# Altium project STM32F031-N30-EVAL.PrjPcb
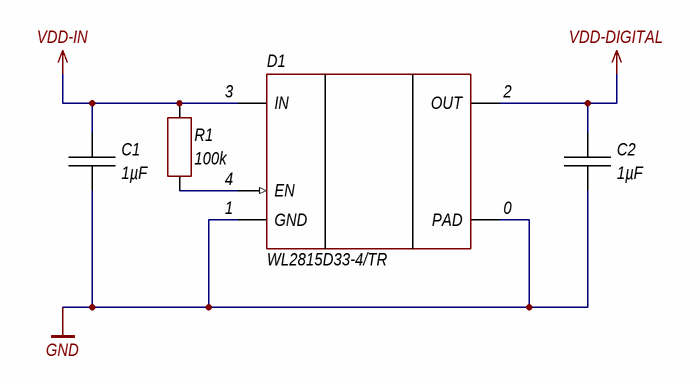
[diagram p0: PowerSupply.SchDoc]
ProjectVersion: 0.1.1; ProjectNumber: STM32F031-N30-EVAL; ProjectDescription2Line: Project description 2; ProjectDescription: Project description; ProjectDateShort: 2021.10; ProjectDate: 16.10.2021; ProjectCompanyName: Azek Clark © 2021; ProjectBoardType: MAINB; ProjectAuthor: Clark A.
8 sheets, 65 parts. Net scope: flat (ports and power ports of the same name join across sheets).
Board file: PCB.PcbDoc
Sheets:
  PowerSupply.SchDoc
  MCU-Power.SchDoc
  MCU-IO.SchDoc
  MCU-Debug.SchDoc
  GPIO-Debug.SchDoc
  Connector-side-1.SchDoc
  Connector-side-2.SchDoc
  LED&Button.SchDoc

## Sheet PowerSupply.SchDoc: =ProjectDescription
size 297 x 209 mm; Author: Clark A.; CompanyName: Azek Clark © 2021; Address1: Address1; Address2: Address2; Address3: Address3; Address4: Address4; DocumentNumber: STM32F031-N30-EVAL-0.1.1-MAINB Э3; SheetNumber: 1; SheetTotal: 7; Scale: 1:1; DocumentType: Схема электрическая принципиальная; FirstReferrence: STM32F031-N30-EVAL; Title2str: Project description 2

### Parts
C1  1µF  [CH0402C]
C2  1µF  [CH0402C]
D1  WL2815D33-4/TR  [DFN1010-4]
R1  100k  [CH0402R]

### Nets
GND: C1.1 C2.1 D1.0(PAD) D1.1(GND)
VDD-DIGITAL: C2.2 D1.2(OUT)
VDD-IN: C1.2 D1.3(IN) R1.2
NetD1_4: D1.4(EN) R1.1

### Notes on the sheet
- Утв.
- Н.контр.
- Т.контр.
- Пров.
- Разраб.
- Изм.
- Лист
- № докум.
- Подп.
- Дата
- Копировал
- Формат А4
- Лит.
- Листов
- Масса
- Масштаб

### Library data of the parts
C1 C2 = Capacitor: Manufacturer: *; Model: *; HelpURL: *; ComponentKind: *; Value: 1µF
D1 = WL2815: LDO; Model: WL2815D33-4/TR; HelpURL: https://www.lcsc.com/product-detail/Linear-Voltage-Regulators-LDO_WILLSEMI-Will-Semicon-WL2815D33-4-TR_C506126.html; ComponentKind: DFN1010-4, 5.25V, 300mA
R1 = Resistor: Manufacturer: *; Model: *; HelpURL: *; ComponentKind: *; Value: 100k

## Sheet MCU-Power.SchDoc: =ProjectDescription
size 297 x 209 mm; Author: Clark A.; CompanyName: Azek Clark © 2021; Address1: Address1; Address2: Address2; Address3: Address3; Address4: Address4; DocumentNumber: STM32F031-N30-EVAL-0.1.1-MAINB Э3; SheetNumber: 2; SheetTotal: 7; Scale: 1:1; DocumentType: Схема электрическая принципиальная; FirstReferrence: STM32F031-N30-EVAL
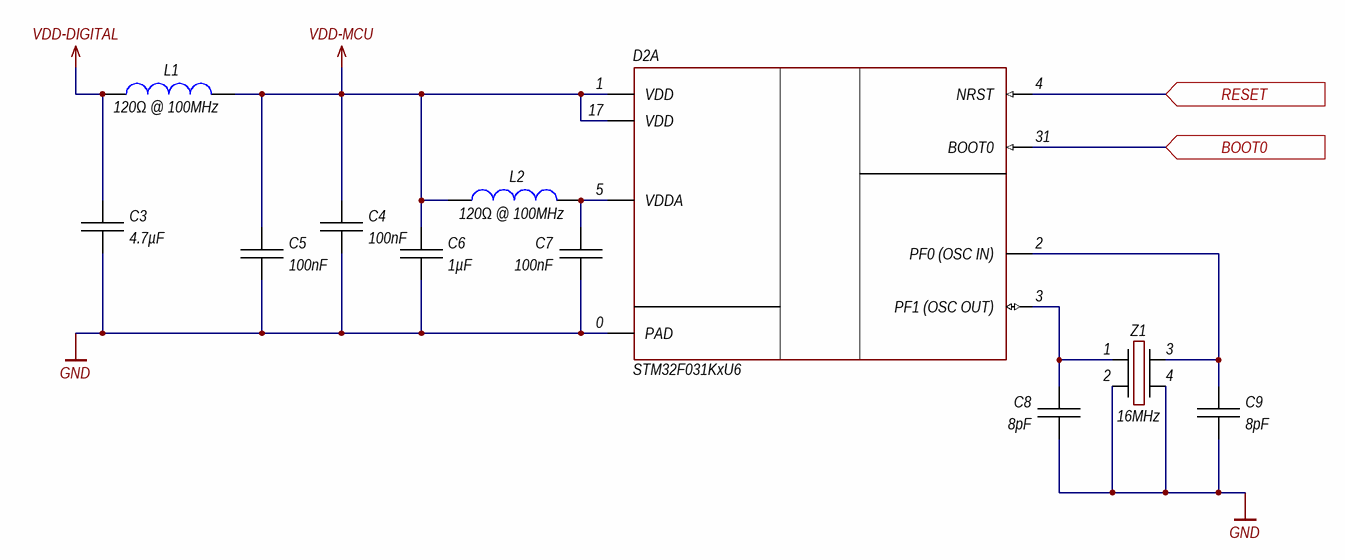
[diagram p1: MCU-Power.SchDoc]

### Parts
C3  4.7µF  [CH0402C]
C4  100nF  [CH0402C]
C5  100nF  [CH0402C]
C6  1µF  [CH0402C]
C7  100nF  [CH0402C]
C8  8pF  [CH0402C]
C9  8pF  [CH0402C]
D2  STM32F031KxU6  [32-UFQFPN]  (part A of 2)
L1  120Ω @ 100MHz  [CH0402L]
L2  120Ω @ 100MHz  [CH0402L]
Z1  16MHz  [OSC: 2520]

### Ports
BOOT0 (in), RESET (in)

### Nets
GND: C3.1 C4.1 C5.1 C6.1 C7.1 C8.1 C9.1 D2.0(PAD) Z1.2 Z1.4
VDD-DIGITAL: C3.2 L1.2
VDD-MCU: C4.2 C5.2 C6.2 D2.1(VDD) D2.17(VDD) L1.1 L2.2
BOOT0: D2.31(BOOT0) ; port BOOT0
RESET: D2.4(NRST) ; port RESET
NetC7_2: C7.2 D2.5(VDDA) L2.1
NetC8_2: C8.2 D2.3(PF1_(OSC_OUT)) Z1.1
NetC9_2: C9.2 D2.2(PF0_(OSC_IN)) Z1.3

### Notes on the sheet
- Изм.
- Лист
- № докум.
- Подп.
- Дата
- Копировал
- Формат А4

### Library data of the parts
C3-C9 = Capacitor: Manufacturer: *; Model: *; HelpURL: *; ComponentKind: *
  C3: Value: 4.7µF
  C4 C5 C7: Value: 100nF
  C6: Value: 1µF
  C8 C9: Value: 8pF
D2 = STM32F031KxU6: STM32, Cortex-M0; Manufacturer: ST Microelectronics; Model: STM32F031KxU6; ComponentKind: STM32, 2.0-3.6V, 32-UFQFPN; HelpURL: https://lcsc.com/product-detail/ST-Microelectronics_STMicroelectronics-STM32F031K6U6_C97412.html
L1 L2 = Inductor: Manufacturer: *; Model: *; HelpURL: *; ComponentKind: *; Value: 120Ω @ 100MHz
Z1 = Generator: Manufacturer: *; Model: *; HelpURL: *; ComponentKind: *; Value: 16MHz

## Sheet MCU-IO.SchDoc: =ProjectDescription
size 297 x 209 mm; Author: Clark A.; CompanyName: Azek Clark © 2021; Address1: Address1; Address2: Address2; Address3: Address3; Address4: Address4; DocumentNumber: STM32F031-N30-EVAL-0.1.1-MAINB Э3; SheetNumber: 3; SheetTotal: 7; Scale: 1:1; DocumentType: Схема электрическая принципиальная; FirstReferrence: STM32F031-N30-EVAL
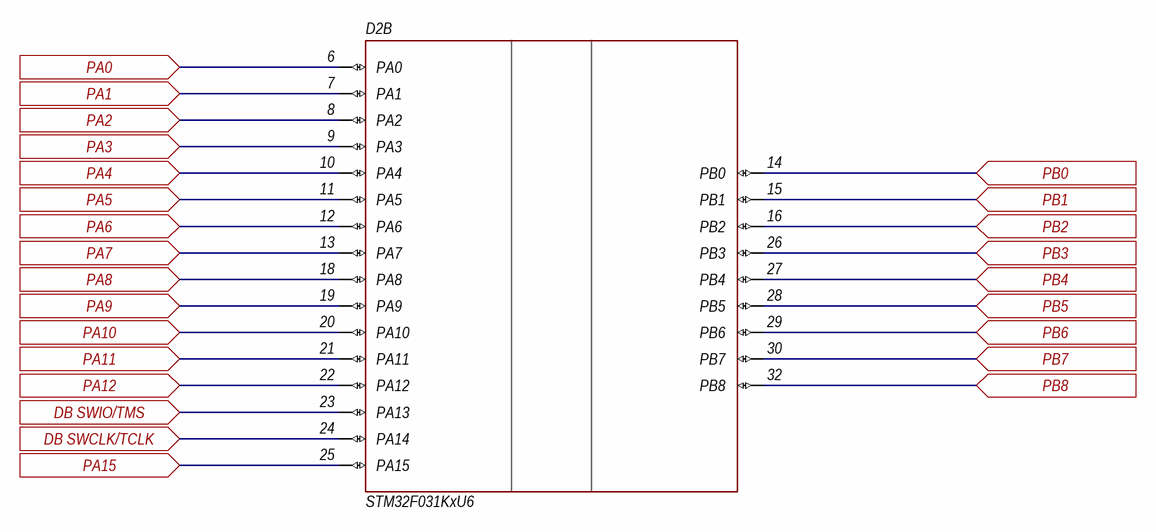
[diagram p2: MCU-IO.SchDoc]

### Parts
D2  STM32F031KxU6  [32-UFQFPN]  (part B of 2)

### Ports
DB SWCLK/TCLK (in), DB SWIO/TMS (in), PA0 (in), PA1 (in), PA2 (in), PA3 (in), PA4 (in), PA5 (in), PA6 (in), PA7 (in), PA8 (in), PA9 (in), PA10 (in), PA11 (in), PA12 (in), PA15 (in), PB0 (in), PB1 (in), PB2 (in), PB3 (in), PB4 (in), PB5 (in), PB6 (in), PB7 (in), PB8 (in)

### Nets
DB SWCLK/TCLK: D2.24(PA14) ; port DB SWCLK/TCLK
DB SWIO/TMS: D2.23(PA13) ; port DB SWIO/TMS
PA0: D2.6(PA0) ; port PA0
PA1: D2.7(PA1) ; port PA1
PA2: D2.8(PA2) ; port PA2
PA3: D2.9(PA3) ; port PA3
PA4: D2.10(PA4) ; port PA4
PA5: D2.11(PA5) ; port PA5
PA6: D2.12(PA6) ; port PA6
PA7: D2.13(PA7) ; port PA7
PA8: D2.18(PA8) ; port PA8
PA9: D2.19(PA9) ; port PA9
PA10: D2.20(PA10) ; port PA10
PA11: D2.21(PA11) ; port PA11
PA12: D2.22(PA12) ; port PA12
PA15: D2.25(PA15) ; port PA15
PB0: D2.14(PB0) ; port PB0
PB1: D2.15(PB1) ; port PB1
PB2: D2.16(PB2) ; port PB2
PB3: D2.26(PB3) ; port PB3
PB4: D2.27(PB4) ; port PB4
PB5: D2.28(PB5) ; port PB5
PB6: D2.29(PB6) ; port PB6
PB7: D2.30(PB7) ; port PB7
PB8: D2.32(PB8) ; port PB8

### Notes on the sheet
- Изм.
- Лист
- № докум.
- Подп.
- Дата
- Копировал
- Формат А4

### Library data of the parts
D2 = STM32F031KxU6: as D2 on sheet MCU-Power; Model: STM32F031KxU6; ComponentKind: STM32, 2.0-3.6V, 32-UFQFPN; HelpURL: https://lcsc.com/product-detail/ST-Microelectronics_STMicroelectronics-STM32F031K6U6_C97412.html

## Sheet MCU-Debug.SchDoc: =ProjectDescription
size 297 x 209 mm; Author: Clark A.; CompanyName: Azek Clark © 2021; Address1: Address1; Address2: Address2; Address3: Address3; Address4: Address4; DocumentNumber: STM32F031-N30-EVAL-0.1.1-MAINB Э3; SheetNumber: 4; SheetTotal: 7; Scale: 1:1; DocumentType: Схема электрическая принципиальная; FirstReferrence: STM32F031-N30-EVAL
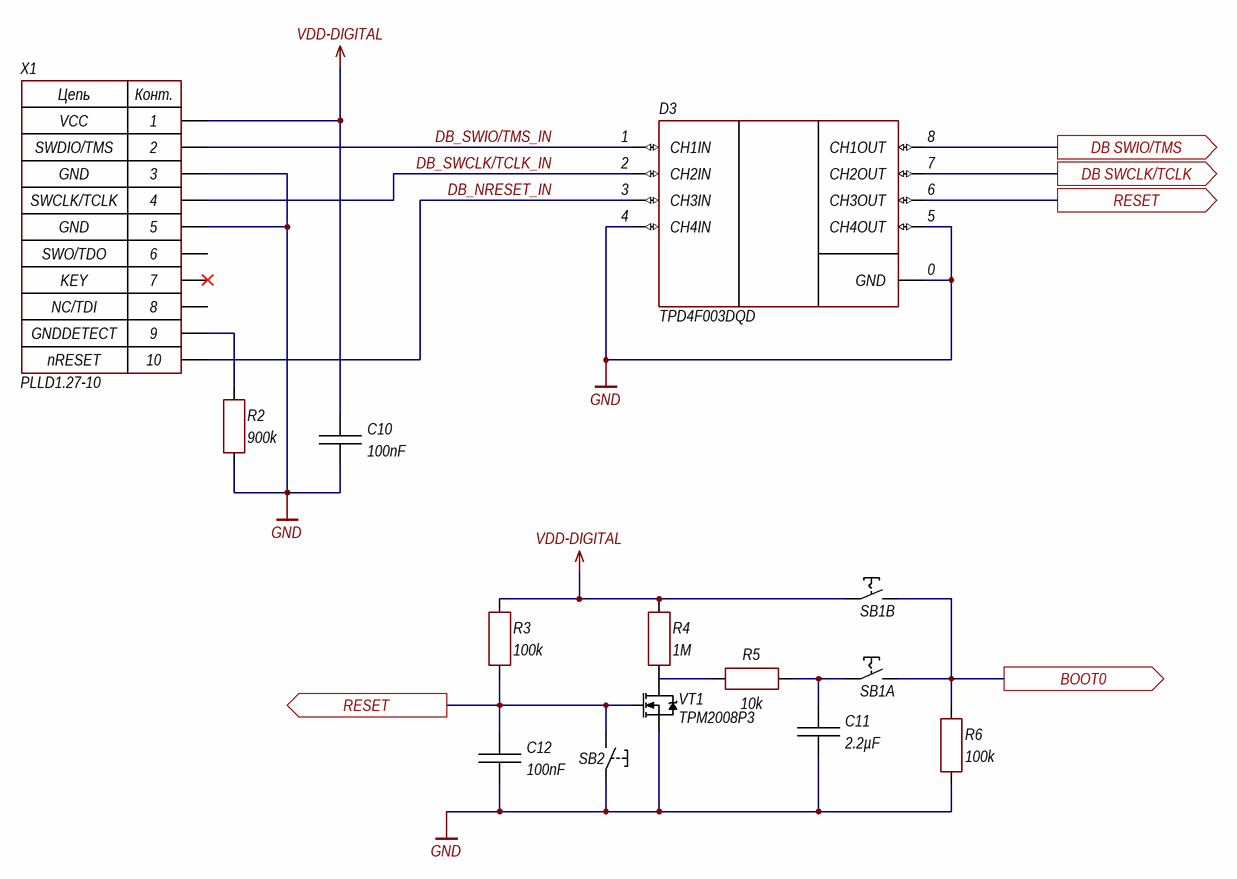
[diagram p3: MCU-Debug.SchDoc]

### Parts
C10  100nF  [CH0402C]
C11  2.2µF  [CH0402C]
C12  100nF  [CH0402C]
D3  TPD4F003DQD  [8-WSON (1.7x1.35 mm)]
R2  900k  [CH0402R]
R3  100k  [CH0402R]
R4  1M  [CH0402R]
R5  10k  [CH0402R]
R6  100k  [CH0402R]
SB1  *  [BUT: DSHP02TS]  (value not drawn)  (parts A,B of 2)
SB2  "Кнопка"  [BUT: YTS-A017]  (value not drawn)
VT1  TPM2008P3  [DFN1006-3L]
X1  PLLD1.27-10  [CON: PLLD-1.27-10]

### Ports
BOOT0 (out), DB SWCLK/TCLK (out), DB SWIO/TMS (out), RESET (out)

### Nets
GND: C10.1 C11.1 C12.1 D3.0(GND) D3.4(CH4IN) D3.5(CH4OUT) R2.1 R6.1 SB2.1 VT1.3(S) X1.3 X1.5
VDD-DIGITAL: C10.2 R3.2 R4.2 SB1.2 X1.1
BOOT0: R6.2 SB1.3 SB1.4 ; port BOOT0
DB SWCLK/TCLK: D3.7(CH2OUT) ; port DB SWCLK/TCLK
DB SWIO/TMS: D3.8(CH1OUT) ; port DB SWIO/TMS
DB_NRESET_IN: D3.3(CH3IN) X1.10
DB_SWCLK/TCLK_IN: D3.2(CH2IN) X1.4
DB_SWIO/TMS_IN: D3.1(CH1IN) X1.2
RESET: C12.2 D3.6(CH3OUT) R3.1 SB2.2 VT1.1(G) ; port RESET
NetC11_2: C11.2 R5.2 SB1.1
NetR2_2: R2.2 X1.9
NetR4_1: R4.1 R5.1 VT1.2(D)

Not connected (* = marked no-connect by the designer): X1 6 7* 8

### Notes on the sheet
- VCC
- SWDIO/TMS
- SWCLK/TCLK
- GND
- SWO/TDO
- KEY
- NC/TDI
- nRESET
- GNDDETECT
- Изм.
- Лист
- № докум.
- Подп.
- Дата
- Копировал
- Формат А4
- (in symbol 10-Connector) Цепь; Конт.

### Library data of the parts
C10-C12 = Capacitor: Manufacturer: *; Model: *; HelpURL: *; ComponentKind: *
  C10 C12: Value: 100nF
  C11: Value: 2.2µF
D3 = TPD4F003: 4-bit IO protection; Manufacturer: Texas Instruments; Model: TPD4F003DQD; ComponentKind: EMI Filter With Integrated ESD Protection; HelpURL: https://www.chipdip.ru/product1/8002950921
R2-R6 = Resistor: Manufacturer: *; Model: *; HelpURL: *; ComponentKind: *
  R2: Value: 900k
  R3 R6: Value: 100k
  R4: Value: 1M
  R5: Value: 10k
SB1 = 2(1)-Switch: 2 Array, latching; Manufacturer: *; Model: *; HelpURL: *; ComponentKind: *
SB2 = 1-Button: Button, no latching; Manufacturer: *; Model: *; HelpURL: *; ComponentKind: *
VT1 = N-chanel: Mosfet; Manufacturer: TECH PUBLIC; Model: TPM2008P3; ComponentKind: 20V, 1.1V, 0.7A; HelpURL: https://www.lcsc.com/product-detail/MOSFETs_TECH-PUBLIC-TPM2008P3_C708974.html
X1 = 10-Connector: Model: PLLD1.27-10; Manufacturer: *; HelpURL: *; ComponentKind: *

## Sheet GPIO-Debug.SchDoc: =ProjectDescription
size 297 x 209 mm; Author: Clark A.; CompanyName: Azek Clark © 2021; Address1: Address1; Address2: Address2; Address3: Address3; Address4: Address4; DocumentNumber: STM32F031-N30-EVAL-0.1.1-MAINB Э3; SheetNumber: 5; SheetTotal: 8; Scale: 1:1; DocumentType: Схема электрическая принципиальная; FirstReferrence: STM32F031-N30-EVAL
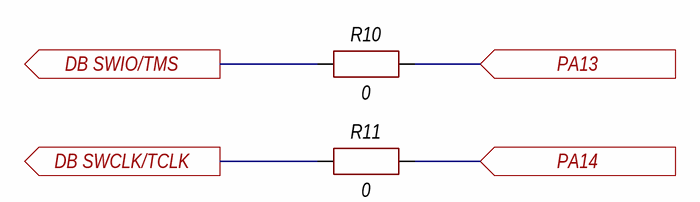
[diagram p4: GPIO-Debug.SchDoc]

### Parts
R10  0  [CH0402R]
R11  0  [CH0402R]

### Ports
DB SWCLK/TCLK (out), DB SWIO/TMS (out), PA13 (in), PA14 (in)

### Nets
DB SWCLK/TCLK: R11.1 ; port DB SWCLK/TCLK
DB SWIO/TMS: R10.1 ; port DB SWIO/TMS
PA13: R10.2 ; port PA13
PA14: R11.2 ; port PA14

### Notes on the sheet
- Изм.
- Лист
- № докум.
- Подп.
- Дата
- Копировал
- Формат А4

### Library data of the parts
R10 R11 = Resistor: Manufacturer: *; Model: *; HelpURL: *; ComponentKind: *; Value: 0

## Sheet Connector-side-1.SchDoc: =ProjectDescription
size 297 x 209 mm; Author: Clark A.; CompanyName: Azek Clark © 2021; Address1: Address1; Address2: Address2; Address3: Address3; Address4: Address4; DocumentNumber: STM32F031-N30-EVAL-0.1.1-MAINB Э3; SheetNumber: 5; SheetTotal: 7; Scale: 1:1; DocumentType: Схема электрическая принципиальная; FirstReferrence: STM32F031-N30-EVAL
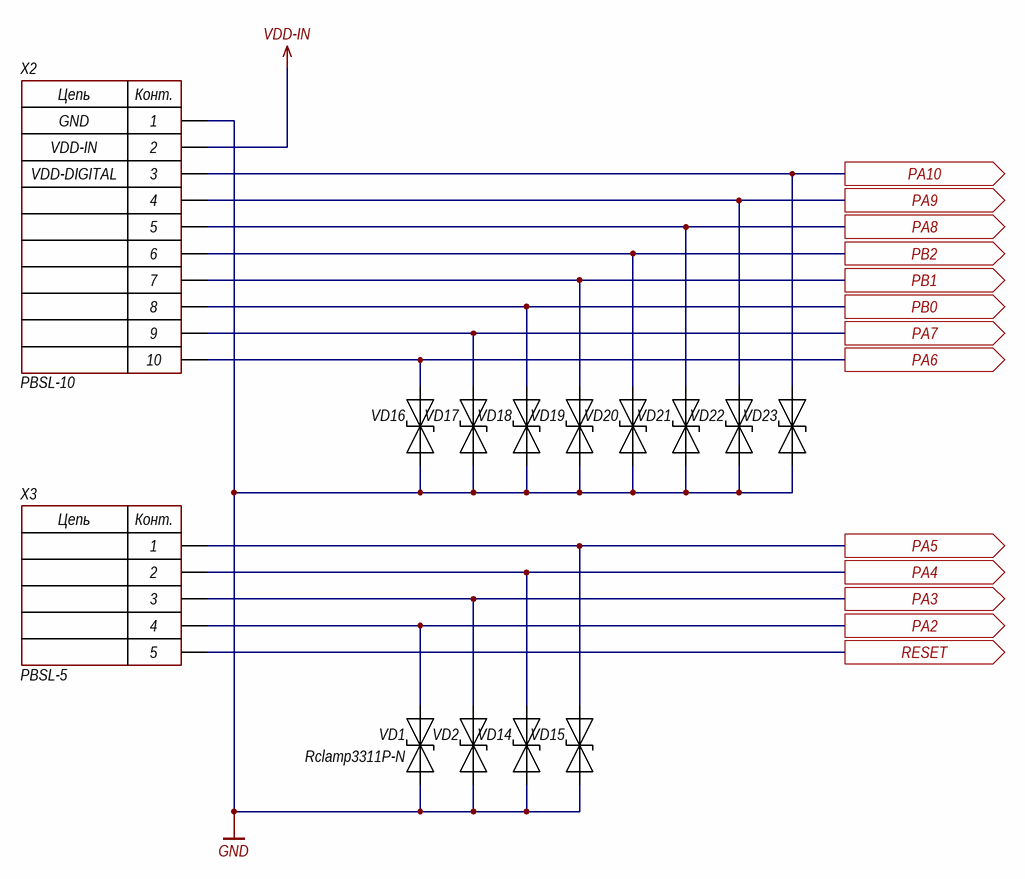
[diagram p5: Connector-side-1.SchDoc]

### Parts
VD1  Rclamp3311P-N  [DFN1006-2]
VD2  Rclamp3311P-N  [DFN1006-2]  (value not drawn)
VD14  Rclamp3311P-N  [DFN1006-2]  (value not drawn)
VD15  Rclamp3311P-N  [DFN1006-2]  (value not drawn)
VD16  Rclamp3311P-N  [DFN1006-2]  (value not drawn)
VD17  Rclamp3311P-N  [DFN1006-2]  (value not drawn)
VD18  Rclamp3311P-N  [DFN1006-2]  (value not drawn)
VD19  Rclamp3311P-N  [DFN1006-2]  (value not drawn)
VD20  Rclamp3311P-N  [DFN1006-2]  (value not drawn)
VD21  Rclamp3311P-N  [DFN1006-2]  (value not drawn)
VD22  Rclamp3311P-N  [DFN1006-2]  (value not drawn)
VD23  Rclamp3311P-N  [DFN1006-2]  (value not drawn)
X2  PBSL-10  [CON: PBSL-10]
X3  PBSL-5  [CON: PBSL-5]

### Ports
PA2 (out), PA3 (out), PA4 (out), PA5 (out), PA6 (out), PA7 (out), PA8 (out), PA9 (out), PA10 (out), PB0 (out), PB1 (out), PB2 (out), RESET (out)

### Nets
GND: VD1.1(A) VD2.1(A) VD14.1(A) VD15.1(A) VD16.1(A) VD17.1(A) VD18.1(A) VD19.1(A) VD20.1(A) VD21.1(A) VD22.1(A) VD23.1(A) X2.1
VDD-IN: X2.2
PA2: VD1.2(C) X3.4 ; port PA2
PA3: VD2.2(C) X3.3 ; port PA3
PA4: VD14.2(C) X3.2 ; port PA4
PA5: VD15.2(C) X3.1 ; port PA5
PA6: VD16.2(C) X2.10 ; port PA6
PA7: VD17.2(C) X2.9 ; port PA7
PA8: VD21.2(C) X2.5 ; port PA8
PA9: VD22.2(C) X2.4 ; port PA9
PA10: VD23.2(C) X2.3 ; port PA10
PB0: VD18.2(C) X2.8 ; port PB0
PB1: VD19.2(C) X2.7 ; port PB1
PB2: VD20.2(C) X2.6 ; port PB2
RESET: X3.5 ; port RESET

### Notes on the sheet
- GND
- VDD-IN
- VDD-DIGITAL
- Изм.
- Лист
- № докум.
- Подп.
- Дата
- Копировал
- Формат А4
- (in symbol 5-Connector) Цепь; Конт.
- (in symbol 10-Connector) Цепь; Конт.

### Library data of the parts
VD1 VD2 VD14-VD23 = TVS-diod: Manufacturer: BORN; ComponentKind: 3.3V, 8V. 10A; Model: Rclamp3311P-N; HelpURL: https://www.lcsc.com/product-detail/ESD-Protection-Devices_BORN-Rclamp3311P-N_C406234.html
X2 = 10-Connector: Model: PBSL-10; Manufacturer: *; HelpURL: *; ComponentKind: *
X3 = 5-Connector: Model: PBSL-5; Manufacturer: *; HelpURL: *; ComponentKind: *

## Sheet Connector-side-2.SchDoc: =ProjectDescription
size 297 x 209 mm; Author: Clark A.; CompanyName: Azek Clark © 2021; Address1: Address1; Address2: Address2; Address3: Address3; Address4: Address4; DocumentNumber: STM32F031-N30-EVAL-0.1.1-MAINB Э3; SheetNumber: 7; SheetTotal: 7; Scale: 1:1; DocumentType: Схема электрическая принципиальная; FirstReferrence: STM32F031-N30-EVAL
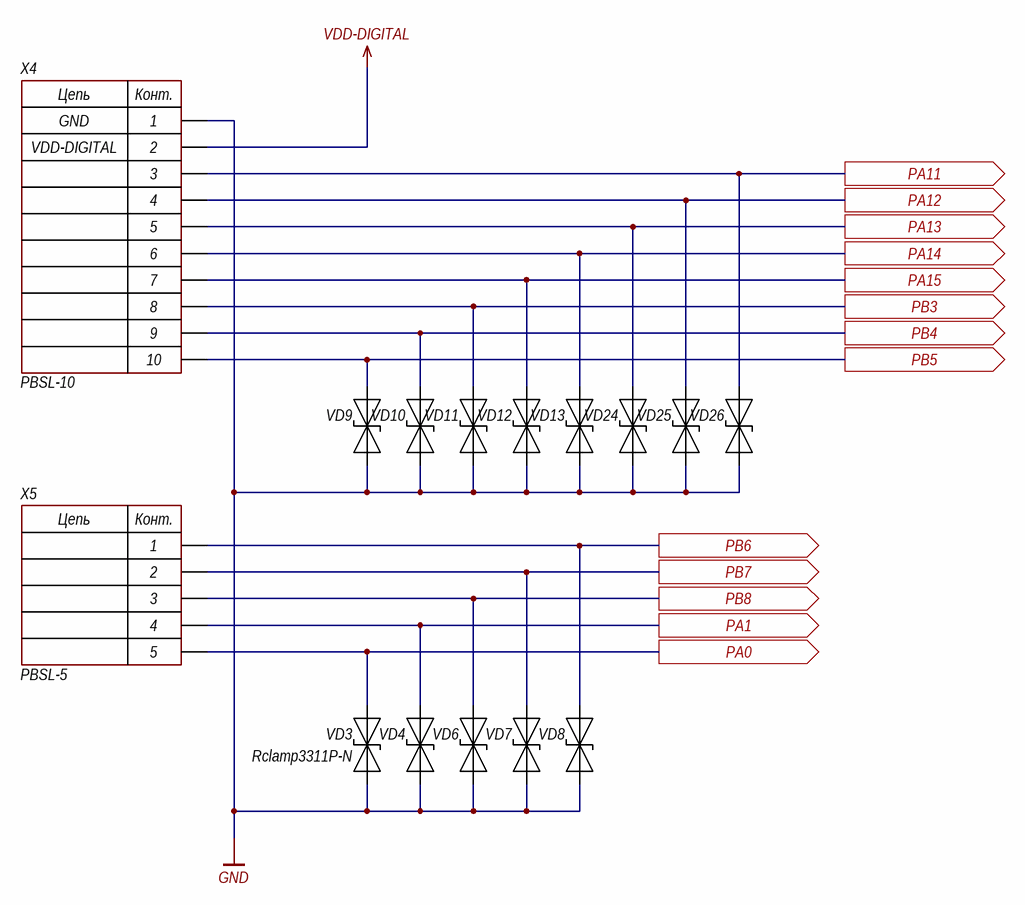
[diagram p6: Connector-side-2.SchDoc]

### Parts
VD3  Rclamp3311P-N  [DFN1006-2]
VD4  Rclamp3311P-N  [DFN1006-2]  (value not drawn)
VD6  Rclamp3311P-N  [DFN1006-2]  (value not drawn)
VD7  Rclamp3311P-N  [DFN1006-2]  (value not drawn)
VD8  Rclamp3311P-N  [DFN1006-2]  (value not drawn)
VD9  Rclamp3311P-N  [DFN1006-2]  (value not drawn)
VD10  Rclamp3311P-N  [DFN1006-2]  (value not drawn)
VD11  Rclamp3311P-N  [DFN1006-2]  (value not drawn)
VD12  Rclamp3311P-N  [DFN1006-2]  (value not drawn)
VD13  Rclamp3311P-N  [DFN1006-2]  (value not drawn)
VD24  Rclamp3311P-N  [DFN1006-2]  (value not drawn)
VD25  Rclamp3311P-N  [DFN1006-2]  (value not drawn)
VD26  Rclamp3311P-N  [DFN1006-2]  (value not drawn)
X4  PBSL-10  [CON: PBSL-10]
X5  PBSL-5  [CON: PBSL-5]

### Ports
PA0 (out), PA1 (out), PA11 (out), PA12 (out), PA13 (out), PA14 (out), PA15 (out), PB3 (out), PB4 (out), PB5 (out), PB6 (out), PB7 (out), PB8 (out)

### Nets
GND: VD3.1(A) VD4.1(A) VD6.1(A) VD7.1(A) VD8.1(A) VD9.1(A) VD10.1(A) VD11.1(A) VD12.1(A) VD13.1(A) VD24.1(A) VD25.1(A) VD26.1(A) X4.1
VDD-DIGITAL: X4.2
PA0: VD3.2(C) X5.5 ; port PA0
PA1: VD4.2(C) X5.4 ; port PA1
PA11: VD26.2(C) X4.3 ; port PA11
PA12: VD25.2(C) X4.4 ; port PA12
PA13: VD24.2(C) X4.5 ; port PA13
PA14: VD13.2(C) X4.6 ; port PA14
PA15: VD12.2(C) X4.7 ; port PA15
PB3: VD11.2(C) X4.8 ; port PB3
PB4: VD10.2(C) X4.9 ; port PB4
PB5: VD9.2(C) X4.10 ; port PB5
PB6: VD8.2(C) X5.1 ; port PB6
PB7: VD7.2(C) X5.2 ; port PB7
PB8: VD6.2(C) X5.3 ; port PB8

### Notes on the sheet
- GND
- VDD-DIGITAL
- Изм.
- Лист
- № докум.
- Подп.
- Дата
- Копировал
- Формат А4
- (in symbol 5-Connector) Цепь; Конт.
- (in symbol 10-Connector) Цепь; Конт.

### Library data of the parts
VD3 VD4 VD6-VD13 VD24-VD26 = TVS-diod: Manufacturer: BORN; ComponentKind: 3.3V, 8V. 10A; Model: Rclamp3311P-N; HelpURL: https://www.lcsc.com/product-detail/ESD-Protection-Devices_BORN-Rclamp3311P-N_C406234.html
X4 = 10-Connector: Model: PBSL-10; Manufacturer: *; HelpURL: *; ComponentKind: *
X5 = 5-Connector: Model: PBSL-5; Manufacturer: *; HelpURL: *; ComponentKind: *

## Sheet LED&Button.SchDoc: =ProjectDescription
size 297 x 209 mm; Author: Clark A.; CompanyName: Azek Clark © 2021; Address1: Address1; Address2: Address2; Address3: Address3; Address4: Address4; DocumentNumber: STM32F031-N30-EVAL-0.1.1-MAINB Э3; SheetNumber: 7; SheetTotal: 7; Scale: 1:1; DocumentType: Схема электрическая принципиальная; FirstReferrence: STM32F031-N30-EVAL
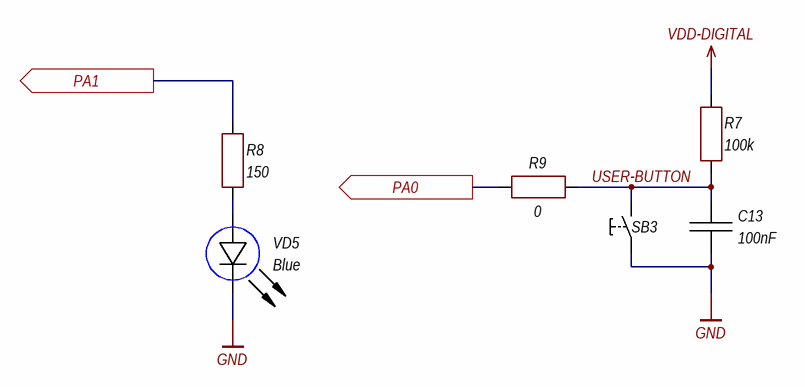
[diagram p7: LED&Button.SchDoc]

### Parts
C13  100nF  [CH0402C]
R7  100k  [CH0402R]
R8  150  [CH0402R]
R9  0  [CH0402R]
SB3  "Кнопка"  [BUT: YTS-A017]  (value not drawn)
VD5  Blue  [CH0402LG]

### Ports
PA0 (out), PA1 (out)

### Nets
GND: C13.1 SB3.1 VD5.2(C)
VDD-DIGITAL: R7.2
PA0: R9.1 ; port PA0
PA1: R8.2 ; port PA1
USER-BUTTON: C13.2 R7.1 R9.2 SB3.2
NetR8_1: R8.1 VD5.1(A)

### Notes on the sheet
- Изм.
- Лист
- № докум.
- Подп.
- Дата
- Копировал
- Формат А4

### Library data of the parts
C13 = Capacitor: Manufacturer: *; Model: *; HelpURL: *; ComponentKind: *; Value: 100nF
R7-R9 = Resistor: Manufacturer: *; Model: *; HelpURL: *; ComponentKind: *
  R7: Value: 100k
  R8: Value: 150
  R9: Value: 0
SB3 = 1-Button: Button, no latching; Manufacturer: *; Model: *; HelpURL: *; ComponentKind: *
VD5 = LED: Manufacturer: *; Model: *; HelpURL: *; ComponentKind: *; Value: Blue

## Nets that join several sheets
GND: PowerSupply (C1.1 C2.1 D1.0 D1.1), MCU-Power (10 pins), MCU-Debug (12 pins), Connector-side-1 (13 pins), Connector-side-2 (14 pins), LED&Button (C13.1 SB3.1 VD5.2)
VDD-DIGITAL: PowerSupply (C2.2 D1.2), MCU-Power (C3.2 L1.2), MCU-Debug (5 pins), Connector-side-2 (X4.2), LED&Button (R7.2)
VDD-IN: PowerSupply (C1.2 D1.3 R1.2), Connector-side-1 (X2.2)
BOOT0: MCU-Power (D2.31), MCU-Debug (R6.2 SB1.3 SB1.4)
DB SWCLK/TCLK: MCU-IO (D2.24), MCU-Debug (D3.7), GPIO-Debug (R11.1)
DB SWIO/TMS: MCU-IO (D2.23), MCU-Debug (D3.8), GPIO-Debug (R10.1)
PA0: MCU-IO (D2.6), Connector-side-2 (VD3.2 X5.5), LED&Button (R9.1)
PA1: MCU-IO (D2.7), Connector-side-2 (VD4.2 X5.4), LED&Button (R8.2)
PA2: MCU-IO (D2.8), Connector-side-1 (VD1.2 X3.4)
PA3: MCU-IO (D2.9), Connector-side-1 (VD2.2 X3.3)
PA4: MCU-IO (D2.10), Connector-side-1 (VD14.2 X3.2)
PA5: MCU-IO (D2.11), Connector-side-1 (VD15.2 X3.1)
PA6: MCU-IO (D2.12), Connector-side-1 (VD16.2 X2.10)
PA7: MCU-IO (D2.13), Connector-side-1 (VD17.2 X2.9)
PA8: MCU-IO (D2.18), Connector-side-1 (VD21.2 X2.5)
PA9: MCU-IO (D2.19), Connector-side-1 (VD22.2 X2.4)
PA10: MCU-IO (D2.20), Connector-side-1 (VD23.2 X2.3)
PA11: MCU-IO (D2.21), Connector-side-2 (VD26.2 X4.3)
PA12: MCU-IO (D2.22), Connector-side-2 (VD25.2 X4.4)
PA13: GPIO-Debug (R10.2), Connector-side-2 (VD24.2 X4.5)
PA14: GPIO-Debug (R11.2), Connector-side-2 (VD13.2 X4.6)
PA15: MCU-IO (D2.25), Connector-side-2 (VD12.2 X4.7)
PB0: MCU-IO (D2.14), Connector-side-1 (VD18.2 X2.8)
PB1: MCU-IO (D2.15), Connector-side-1 (VD19.2 X2.7)
PB2: MCU-IO (D2.16), Connector-side-1 (VD20.2 X2.6)
PB3: MCU-IO (D2.26), Connector-side-2 (VD11.2 X4.8)
PB4: MCU-IO (D2.27), Connector-side-2 (VD10.2 X4.9)
PB5: MCU-IO (D2.28), Connector-side-2 (VD9.2 X4.10)
PB6: MCU-IO (D2.29), Connector-side-2 (VD8.2 X5.1)
PB7: MCU-IO (D2.30), Connector-side-2 (VD7.2 X5.2)
PB8: MCU-IO (D2.32), Connector-side-2 (VD6.2 X5.3)
RESET: MCU-Power (D2.4), MCU-Debug (5 pins), Connector-side-1 (X3.5)